# Altium schematic sheet EVK-IRIS-W1-DEBUG INTERFACE.SchDoc
size A3; DocumentNumber: 14; SheetNumber: 14; SheetTotal: 14
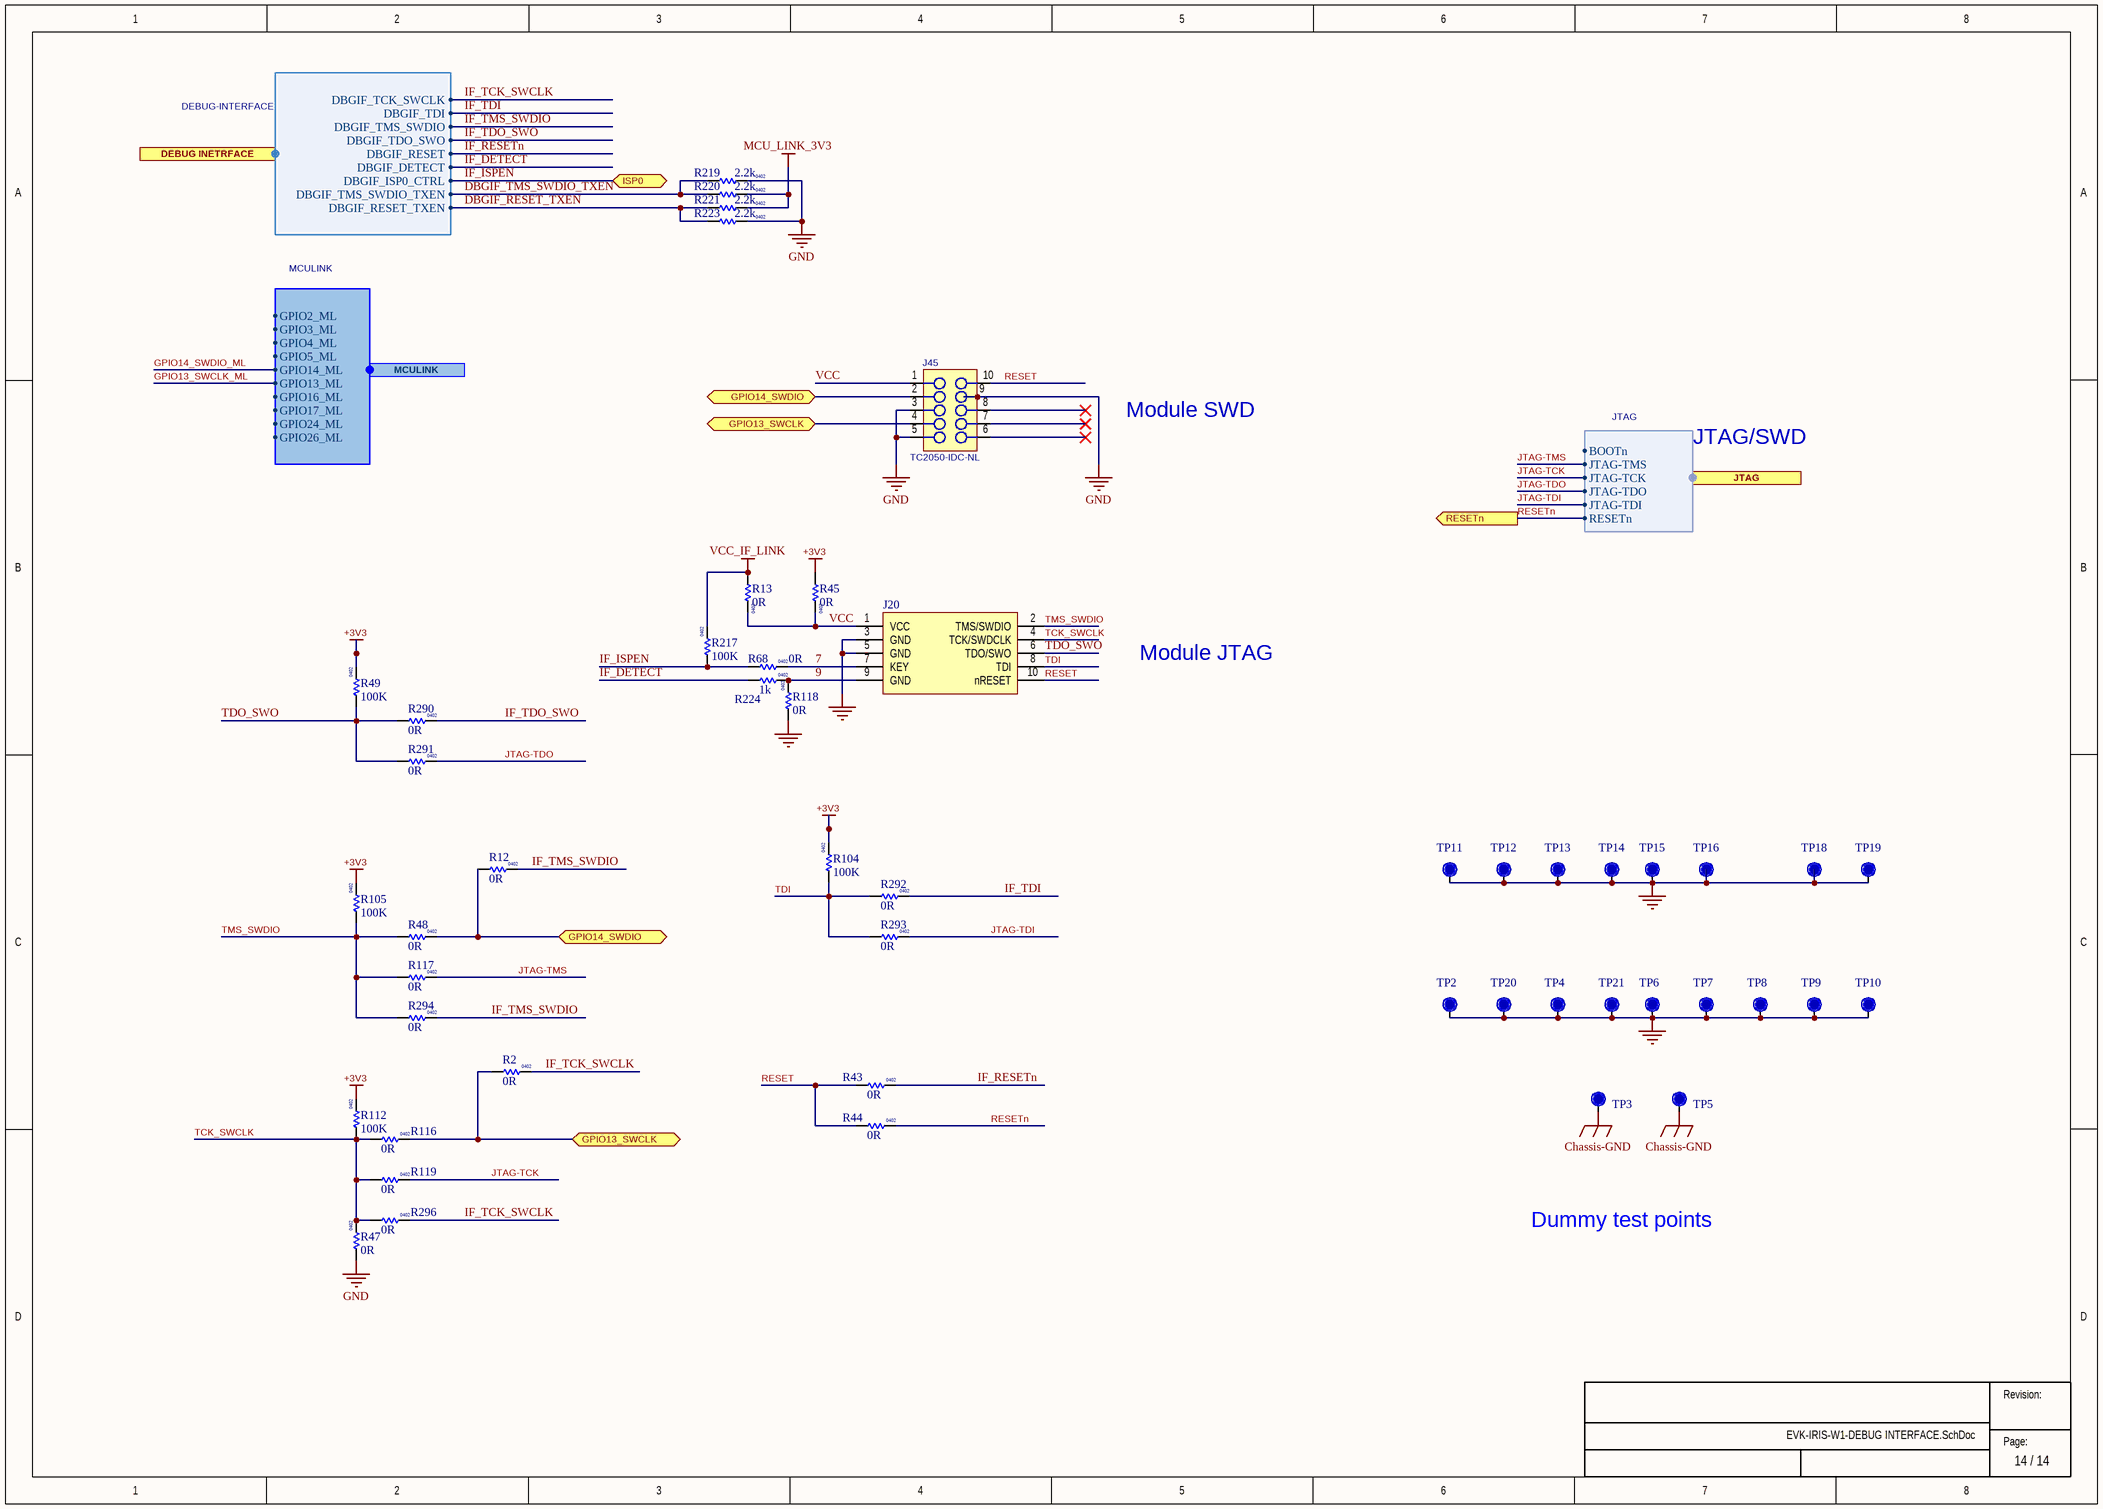
[diagram p0: EVK-IRIS-W1-DEBUG INTERFACE.SchDoc]

## Parts
J20  (no value)  [HDR.050P-10Pin-2x5-SMT_Key]
J45  TC2050-IDC-NLDNP  [TC2050-IDC-NL]  (value not drawn)  (no BOM)
R2  value 0R  Size: 0402  [RES 0402 HD]
R12  value 0R  Size: 0402  [RES 0402 HD]
R13  value 0R  Size: 0402  [RES 0402 HD]
R43  value 0R  Size: 0402  [RES 0402 HD]
R44  value 0R  Size: 0402  [RES 0402 HD]
R45  value 0R  Size: 0402  [RES 0402 HD]
R47  value 0R  Size: 0402  [RES 0402 HD]
R48  value 0R  Size: 0402  [RES 0402 HD]
R49  value 100K  Size: 0402  [RES 0402 HD]
R68  value 0R  Size: 0402  [RES 0402 HD]
R104  value 100K  Size: 0402  [RES 0402 HD]
R105  value 100K  Size: 0402  [RES 0402 HD]
R112  value 100K  Size: 0402  [RES 0402 HD]
R116  value 0R  Size: 0402  [RES 0402 HD]
R117  value 0R  Size: 0402  [RES 0402 HD]
R118  value 0R  Size: 0402  [RES 0402 HD]
R119  value 0R  Size: 0402  [RES 0402 HD]
R217  value 100K  Size: 0402  [RES 0402 HD]
R219  value 2.2k  Size: 0402  [RES 0402 HD]
R220  value 2.2k  Size: 0402  [RES 0402 HD]
R221  value 2.2k  Size: 0402  [RES 0402 HD]
R223  value 2.2k  Size: 0402  [RES 0402 HD]
R224  value 1k  Size: 0402  [RES 0402 HD]
R290  value 0R  Size: 0402  [RES 0402 HD]
R291  value 0R  Size: 0402  [RES 0402 HD]
R292  value 0R  Size: 0402  [RES 0402 HD]
R293  value 0R  Size: 0402  [RES 0402 HD]
R294  value 0R  Size: 0402  [RES 0402 HD]
R296  value 0R  Size: 0402  [RES 0402 HD]
TP2  TP  [TP10R]  (value not drawn)
TP3  TP  [TP10R]  (value not drawn)
TP4  TP  [TP10R]  (value not drawn)
TP5  TP  [TP10R]  (value not drawn)
TP6  TP  [TP10R]  (value not drawn)
TP7  TP  [TP10R]  (value not drawn)
TP8  TP  [TP10R]  (value not drawn)
TP9  TP  [TP10R]  (value not drawn)
TP10  TP  [TP10R]  (value not drawn)
TP11  TP  [TP10R]  (value not drawn)
TP12  TP  [TP10R]  (value not drawn)
TP13  TP  [TP10R]  (value not drawn)
TP14  TP  [TP10R]  (value not drawn)
TP15  TP  [TP10R]  (value not drawn)
TP16  TP  [TP10R]  (value not drawn)
TP18  TP  [TP10R]  (value not drawn)
TP19  TP  [TP10R]  (value not drawn)
TP20  TP  [TP10R]  (value not drawn)
TP21  TP  [TP10R]  (value not drawn)

## Ports
DEBUG INETRFACE (harness DEBUG-INTERFACE), GPIO13_SWCLK (bidir), GPIO14_SWDIO (bidir), ISP0 (bidir), JTAG (harness JTAG), MCULINK (harness MCULINK), RESETn (out)

## Harnesses
JTAG: JTAG-TCK, JTAG-TDI, JTAG-TDO, JTAG-TMS, RESETn, BOOTn
DEBUG-INTERFACE: DBGIF_TCK_SWCLK, DBGIF_TDI, DBGIF_TMS_SWDIO, DBGIF_TDO_SWO, DBGIF_RESET, DBGIF_DETECT, DBGIF_ISP0_CTRL, DBGIF_TMS_SWDIO_TXEN, DBGIF_RESET_TXEN
MCULINK: GPIO2_ML, GPIO3_ML, GPIO4_ML, GPIO5_ML, GPIO13_ML, GPIO14_ML, GPIO16_ML, GPIO17_ML, GPIO24_ML, GPIO26_ML

## Nets
+3V3: R45.1 R49.2 R104.2 R105.2 R112.2
Chassis-GND: TP3.1 TP5.1
GND: J20.3(GND) J20.5(GND) J45.3 J45.5 J45.9 R47.1 R118.1 R219.2 R223.2 TP2.1 TP4.1 TP6.1 TP7.1 TP8.1 TP9.1 TP10.1 TP11.1 TP12.1 TP13.1 TP14.1 TP15.1 TP16.1 TP18.1 TP19.1 TP20.1 TP21.1
MCU_LINK_3V3: R220.1 R221.2
VCC_IF_LINK: R13.1 R217.2
7: J20.7(KEY) R68.2
9: J20.9(GND) R118.2 R224.2
DBGIF_RESET_TXEN: R221.1 R223.1 ; port DEBUG INETRFACE.DBGIF_RESET_TXEN
DBGIF_TMS_SWDIO_TXEN: R219.1 R220.2 ; port DEBUG INETRFACE.DBGIF_TMS_SWDIO_TXEN
GPIO13_SWCLK: J45.4 R2.1 R116.2 ; port GPIO13_SWCLK
GPIO13_SWCLK_ML: port MCULINK.GPIO13_ML
GPIO14_SWDIO: J45.2 R12.1 R48.2 ; port GPIO14_SWDIO
GPIO14_SWDIO_ML: port MCULINK.GPIO14_ML
IF_DETECT: R224.1 ; port DEBUG INETRFACE.DBGIF_DETECT
IF_ISPEN: R68.1 R217.1 ; port ISP0, port DEBUG INETRFACE.DBGIF_ISP0_CTRL
IF_RESETn: R43.2 ; port DEBUG INETRFACE.DBGIF_RESET
IF_TCK_SWCLK: R2.2 R296.2 ; port DEBUG INETRFACE.DBGIF_TCK_SWCLK
IF_TDI: R292.2 ; port DEBUG INETRFACE.DBGIF_TDI
IF_TDO_SWO: R290.2 ; port DEBUG INETRFACE.DBGIF_TDO_SWO
IF_TMS_SWDIO: R12.2 R294.2 ; port DEBUG INETRFACE.DBGIF_TMS_SWDIO
JTAG-TCK: R119.2 ; port JTAG.JTAG-TCK
JTAG-TDI: R293.2 ; port JTAG.JTAG-TDI
JTAG-TDO: R291.2 ; port JTAG.JTAG-TDO
JTAG-TMS: R117.2 ; port JTAG.JTAG-TMS
RESET: J20.10(nRESET) J45.10 R43.1 R44.1
RESETn: R44.2 ; port RESETn, port JTAG.RESETn
TCK_SWCLK: J20.4(TCK/SWDCLK) R47.2 R112.1 R116.1 R119.1 R296.1
TDI: J20.8(TDI) R104.1 R292.1 R293.1
TDO_SWO: J20.6(TDO/SWO) R49.1 R290.1 R291.1
TMS_SWDIO: J20.2(TMS/SWDIO) R48.1 R105.1 R117.1 R294.1
VCC: J20.1(VCC) J45.1 R13.2 R45.2

Not connected (* = marked no-connect by the designer): J45 6* 7* 8*

## Notes on the sheet
- Module SWD
- JTAG/SWD
- Module JTAG
- Dummy test points
- Revision:
- Page:

## Library data of the parts
J20 = 130-00099: Header 0.05" 10Pin 2Row SMD Black; Part Name: CON HDR 0.05" 10Pin 2Row SMD Black; Manufacturer 1: Samtec; Manufacturer Part Number 1: FTSH-105-01-F-DV-K; Use in new designs: Yes; UBX Code: None; Item Phase: In Production; Part Number: 130-00099; Revision: 0A; Supplier 1: Digi-Key; Supplier Part Number 1: SAM8796-ND; Height: 6mm; Pins: 10; Manufacturer 2: None; Max Operating Temp: 125; Supplier 2: None; Supplier Part Number 2: None; Voltage: None; Diameter: None; Min Operating Temp: -55; Manufacturer Part Number 2: None
J45 = TC2050-IDC-NL: CON PADS FOR CBL PLUG-OF-NAILS 10-PIN NO LEGS; Manufacturer: TAG Connect; Added By: Paul B; Manufacturer P/N: TC2050-IDC-NL; Part Number: TC2050-IDC-NL; Size: 6.1mm x 9.9mm; Height: 0; DNP: DNP; Added Date: 12/3/2015
R2 R12 R13 R43-R45 R47 R48 R68 R116-R119 R290-R294 R296 = UBXH18-0003002: RES THICK FILM CHIP 0402 0R 0 100mW; Manufacturer: KOA; Manufacturer P/N: RK73Z1ETTD; Tolerance: 0; Editor: charlotte.biber; Released by: peter.mueller; Env: ROHS; Permitted Use: Volume Products; Perferred: PREF; Mfg P/N Status: NRND; Mfg P/N Split: 100; Mfg P/N Released: Yes; Part Number: UBXH18-0003002; Manufacturer 2: YAGEO; Max Power: 100mW; Part Type: Resistor; Release Data: 2012-06-05T09:49:55; UBX Wiki: https://wiki.u-blox.com/bin/view/Operations/PartDetails?index=6611; RefDes: R; Manufacturer P/N 2: 2322_705_91001_L; Mfg P/N Status 2: NRND; Mfg P/N Split 2: 0; Mfg P/N Released 2: Yes
R49 R104 R105 R112 R217 = UBXH18-0000005: RES THICK FILM CHIP 0402 100K 1% 63mW; Manufacturer: KOA; Manufacturer P/N: RK73H1ETTP1003F; Editor: dario.antonaz; Released by: sandro.sestan; Env: ROHS; Permitted Use: Volume Products; Mfg P/N Status: Active; Mfg P/N Split: 100; Mfg P/N Released: Yes; Part Number: UBXH18-0000005; Manufacturer 2: ROHM; Tolerance: 1%; Max Power: 63mW; Part Type: Resistor; Release Data: 2009-11-30T11:05:22; UBX Wiki: https://wiki.u-blox.com/bin/view/Operations/PartDetails?index=8114; Perferred: N/A; RefDes: R; Mfg P/N Datasheet: https://wiki.u-blox.com/bin/view/Generic/Docs/DocumentSummary?index=8222; Manufacturer P/N 2: MCR01MZPF1003; Mfg P/N Status 2: Active; Mfg P/N Split 2: 0; Mfg P/N Released 2: Yes; Mfg P/N Datasheet 2: https://wiki.u-blox.com/bin/view/Generic/Docs/DocumentSummary?index=8186
R219-R221 R223 = 180-00023: Resistor, 2.2Kohm, 1%, 1/16W, 0402; Manufacturer 1: Rohm Semiconductor; Manufacturer Part Number 1: MCR01MRTF2201; Part Name: RES SMD 2.2K OHM 1% 1/16W 0402; Item Phase: In Production; Tolerance: +/- 1%; Use in new designs: Yes; Voltage: None; Part Number: 180-00023; Supplier 1: Digi-Key; Supplier Part Number 1: RHM2.20KCDCT-ND; Manufacturer 2: Yageo; Manufacturer Part Number 2: RC0402FR-072K2L; Supplier 2: Digi-Key; Supplier Part Number 2: 311-2.20KLRCT-ND; Height: 0.4mm; Max Operating Temp: 155; Min Operating Temp: -55; Pins: 2; Power: 1/16W; Revision: 0A; UBX Code: None
R224 = 180-00021: Resistor 1k ohm 1% 1/16W, 0402; Manufacturer 1: Hong Kong Resistors Manufactory; Manufacturer Part Number 1: RCT021KFLF; Part Name: RES SMD 1K OHM 1% 1/16W 0402; Item Phase: In Production; Tolerance: +/- 1%; Use in new designs: Yes; Voltage: None; Part Number: 180-00021; Supplier 1: None; Supplier Part Number 1: None; Manufacturer 2: Yageo; Manufacturer Part Number 2: RC0402FR-071KL; Supplier 2: Digi-Key; Supplier Part Number 2: 311-1.00KLRCT-ND; Height: 0.4mm; Max Operating Temp: 155; Min Operating Temp: -55; Pins: 2; Power: 1/16W; Revision: 0E; UBX Code: None
TP2-TP16 TP18-TP21 = TP10R: Testpoint, Round 1.0mm Dia; Added By: Jeremy D; Part Number: TP10R; Size: 1.0mm; Height: 0; DNP: DNP; Added Date: 2015-02-01; Checked By: Paul B; Checked Date: 2015-02-05